# Altium schematic sheet DAC.SchDoc
size B; SheetNumber: 4; SheetTotal: 8
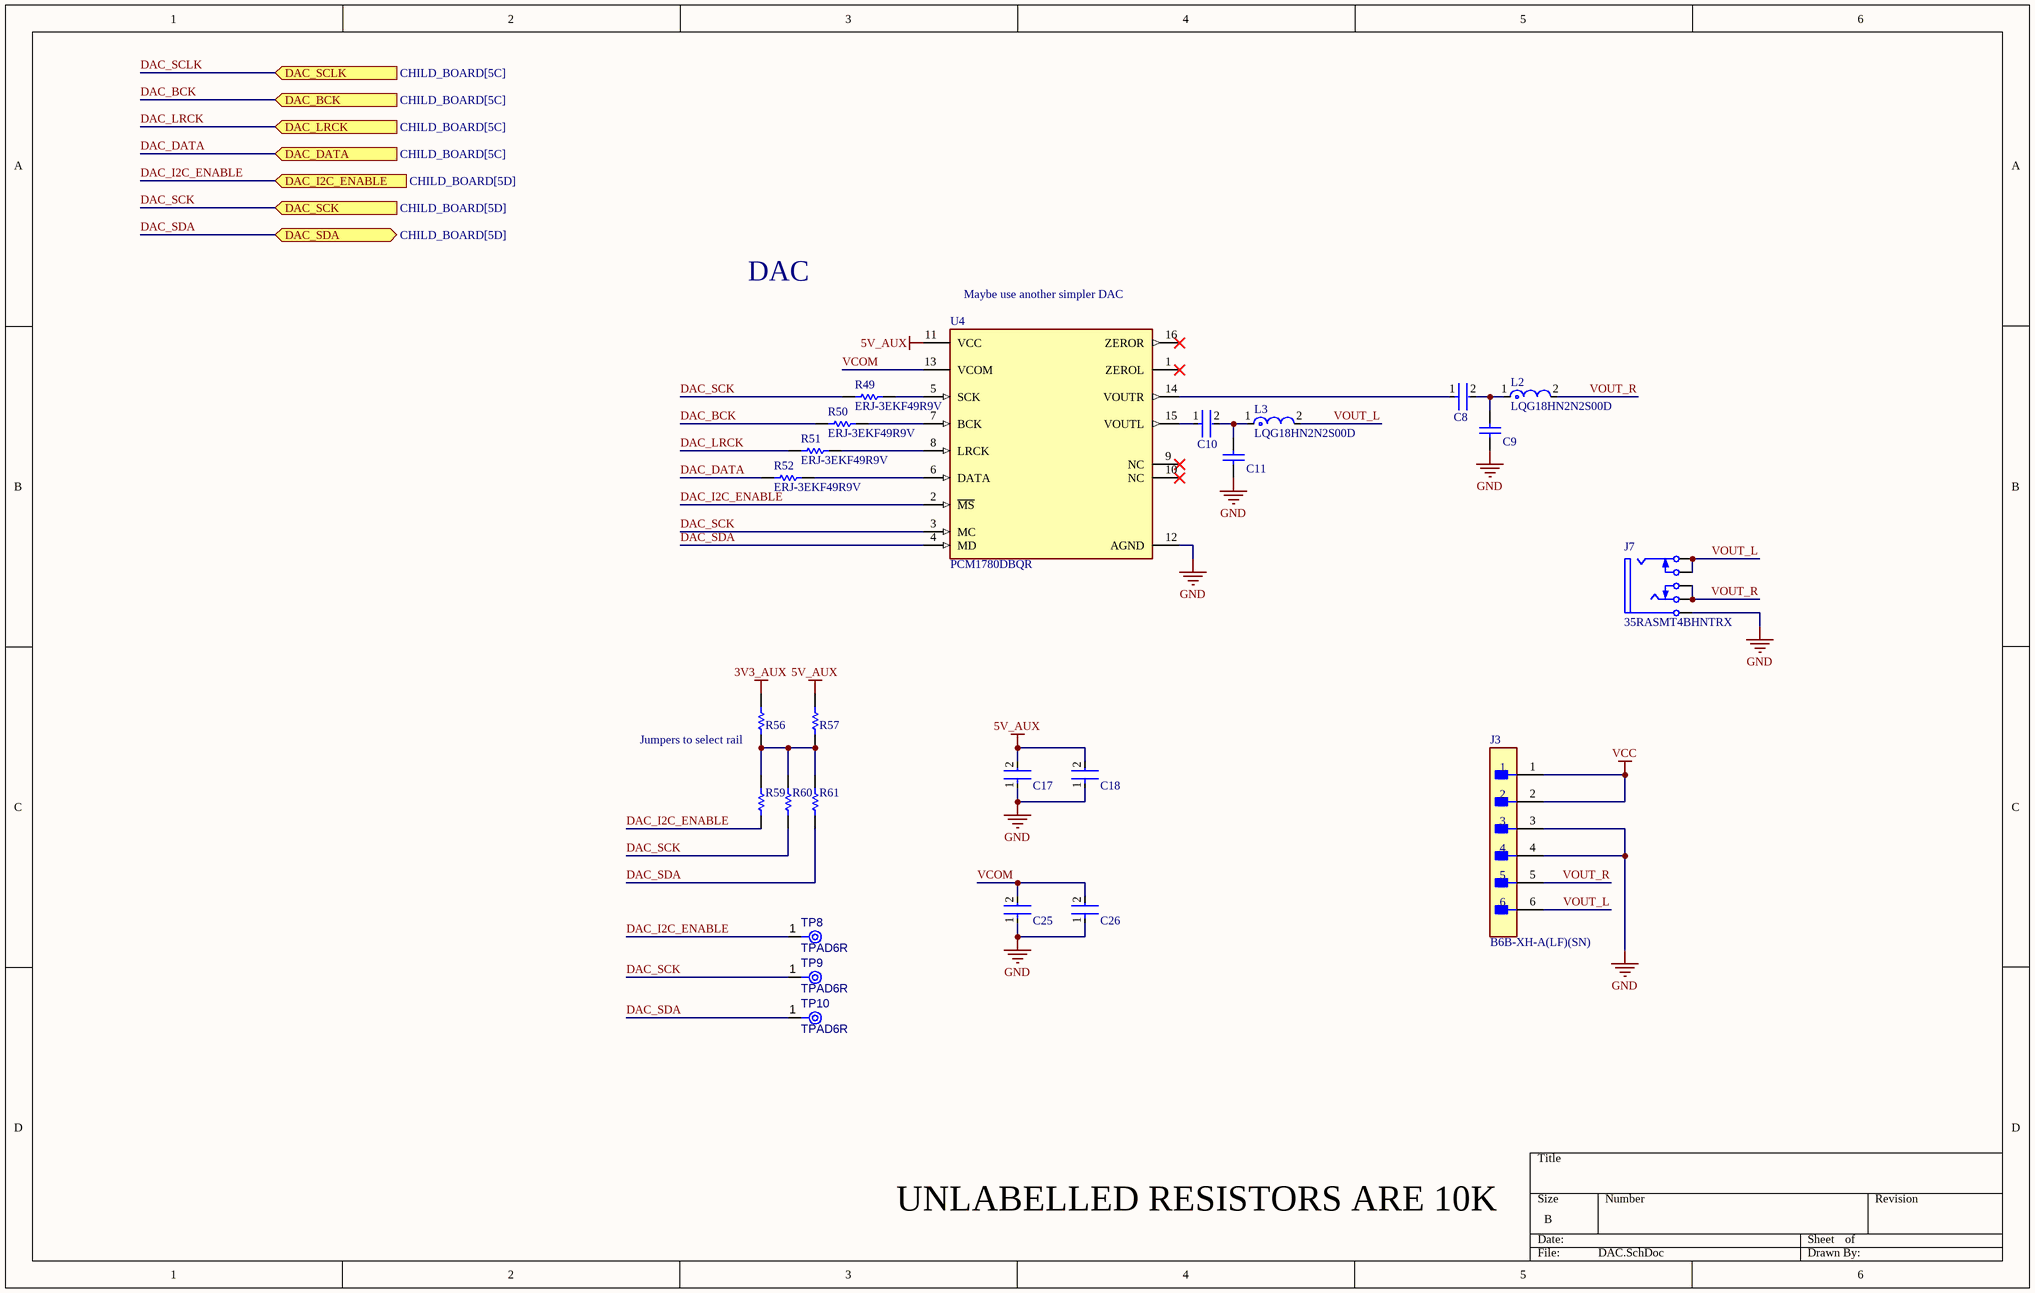
[diagram p0: DAC.SchDoc]

## Parts
C8  GRM188R60J106ME47D  [FP-GRM188-0_1-e0_2_0_55-IPC_A]  (value not drawn)
C9  0603 CAP  [CAPC1608X90X40ML10T20]  (value not drawn)
C10  GRM188R60J106ME47D  [FP-GRM188-0_1-e0_2_0_55-IPC_A]  (value not drawn)
C11  0603 CAP  [CAPC1608X90X40ML10T20]  (value not drawn)
C17  GRM188R60J106ME47D  [FP-GRM188-0_1-e0_2_0_55-IPC_A]  (value not drawn)
C18  C1005X7R1H104K050BB  [FP-C1005-050-0_05-IPC_C]  (value not drawn)
C25  GRM188R60J106ME47D  [FP-GRM188-0_1-e0_2_0_55-IPC_A]  (value not drawn)
C26  C1005X7R1H104K050BB  [FP-C1005-050-0_05-IPC_C]  (value not drawn)
J3  B6B-XH-A(LF)(SN)  [FP-B6B-XH-A_LF_SN-MFG]
J7  35RASMT4BHNTRX  [SWIT-35RASMT4BHNTRX_V]
L2  LQG18HN2N2S00D  [FP-LQG18HH_00-IPC_A]
L3  LQG18HN2N2S00D  [FP-LQG18HH_00-IPC_A]
R49  ERJ-3EKF49R9V  [RESC1608X55X30ML15T15]
R50  ERJ-3EKF49R9V  [RESC1608X55X30ML15T15]
R51  ERJ-3EKF49R9V  [RESC1608X55X30ML15T15]
R52  ERJ-3EKF49R9V  [RESC1608X55X30ML15T15]
R56  0402 JUMPER 0 OHM  [RESC1005X40X25NL05T05]  (value not drawn)
R57  0402 JUMPER 0 OHM  [RESC1005X40X25NL05T05]  (value not drawn)
R59  ERJ3EKF1002V  [RESC1609X55X30LL15T15]  (value not drawn)
R60  ERJ3EKF1002V  [RESC1609X55X30LL15T15]  (value not drawn)
R61  ERJ3EKF1002V  [RESC1609X55X30LL15T15]  (value not drawn)
TP8  TPAD6R  [TP06R]  (no BOM)
TP9  TPAD6R  [TP06R]  (no BOM)
TP10  TPAD6R  [TP06R]  (no BOM)
U4  PCM1780DBQR  [FP-DBQ0016A-IPC_C]

## Ports
DAC_BCK (in, see CHILD_BOARD[5C]), DAC_DATA (in, see CHILD_BOARD[5C]), DAC_I2C_ENABLE (in, see CHILD_BOARD[5D]), DAC_LRCK (in, see CHILD_BOARD[5C]), DAC_SCK (in, see CHILD_BOARD[5D]), DAC_SCLK (in, see CHILD_BOARD[5C]), DAC_SDA (bidir, see CHILD_BOARD[5D])

## Nets
3V3_AUX: R56.2
5V_AUX: C17.2 C18.2 R57.2 U4.11(VCC)
GND: C9.1 C11.1 C17.1 C18.1 C25.1 C26.1 J3.3 J3.4 J7.1 U4.12(AGND)
VCC: J3.1 J3.2
DAC_BCK: R50.2 ; port DAC_BCK
DAC_DATA: R52.2 ; port DAC_DATA
DAC_I2C_ENABLE: R59.1 TP8.1(TP) U4.2(~{MS}) ; port DAC_I2C_ENABLE
DAC_LRCK: R51.2 ; port DAC_LRCK
DAC_SCK: R49.2 R60.1 TP9.1(TP) U4.3(MC) ; port DAC_SCK
DAC_SCLK: port DAC_SCLK
DAC_SDA: R61.1 TP10.1(TP) U4.4(MD) ; port DAC_SDA
VCOM: C25.2 C26.2 U4.13(VCOM)
VOUT_L: J3.6 J7.2 J7.4 L3.2
VOUT_R: J3.5 J7.3 J7.5 L2.2
NetC8_1: C8.1 U4.14(VOUTR)
NetC8_2: C8.2 C9.2 L2.1
NetC10_1: C10.1 U4.15(VOUTL)
NetC10_2: C10.2 C11.2 L3.1
NetR49_1: R49.1 U4.5(SCK)
NetR50_1: R50.1 U4.7(BCK)
NetR51_1: R51.1 U4.8(LRCK)
NetR52_1: R52.1 U4.6(DATA)
NetR56_1: R56.1 R57.1 R59.2 R60.2 R61.2

Not connected (* = marked no-connect by the designer): U4 1(ZEROL)* 9(NC)* 10(NC)* 16(ZEROR)*

## Notes on the sheet
- DAC
- (near U4) Maybe use another simpler DAC
- (near R56) Jumpers to select rail
- UNLABELLED RESISTORS ARE 10K

## Library data of the parts
C8 C10 C17 C25 = CMP-2006-02792-2: Chip Multilayer Ceramic Capacitors for General Purpose, 0603, 10uF, X5R, 15%, 20%, 6.3V; Packaging: Tape and Reel; Voltage Rating (DC): 6.3V; Width: 0.031inch; Termination: SMD/SMT; Dielectric: X5R; Package Quantity: 4000; Voltage Rating: 6.3V; Capacitance: 10uF; Case/Package: 0603; Min Operating Temperature: -55°C; Voltage: 6.3V; Length: 1.6mm; Thickness: 0.035inch; Lead Free: Lead Free; Depth: 0.8mm; Case Code (Imperial): 0603; Max Operating Temperature: 85°C; Material: Ceramic; Height: 0.8mm; Tolerance: 20%; Mount: Surface Mount; REACH SVHC: No SVHC; Radiation Hardening: No; Case Code (Metric): 1608
C9 C11 = CMP-001-00087-1: 0pF 0603 capacitor placeholder
C18 C26 = CMP-2000-05393-2: Multilayer Ceramic Capacitors 100nF ±10% 50V X7R SMD 0402; Voltage: 50V; Dielectric Material: Ceramic; Min Operating Temperature: -55°C; Depth: 0.5mm; Radiation Hardening: No; RoHS Compliant: Yes; Voltage Rating (DC): 50V; Lead Free: Lead Free; Resistor Type: Ceramic; Height: 0.5mm; Dielectric: X7R; Thickness: 0.022inch; Case/Package: 0402; Case Code (Metric): 1005; Termination: SMD/SMT; Capacitance: 100nF; Packaging: Tape and Reel; Max Operating Temperature: 125°C; Mount: Surface Mount; Package Quantity: 1; Width: 0.02inch; Weight: 2.3E-05oz; Voltage Rating: 50V; Tolerance: 10%; Construction: Flat; Case Code (Imperial): 0402; Length: 1mm; REACH SVHC: No SVHC; Series: C
J3 = CMP-17439-000076-1: CONN HEADER VERT 6POS 2.5MM
J7 = CMP-1772-00001-1: Female 3.5 mm Phone Jack, 5 Position, Height 5 mm, RoHS, Tape and Reel; Current Rating: 50 mA; Voltage Rating (DC): 12 V; ComponentLink1URL: http://www.switchcraft.com/; ComponentLink2Description: Datasheet; ComponentLink2URL: http://www.switchcraft.com/Drawings/35rasmt4bhntrx_cd.pdf; PackageDescription: Female 3.5 mm Phone Jack, 5 Position, Height 5 mm; PackageReference: 35RASMT4BHNTRX; Mount: Through Hole; DatasheetVersion: Rev. C, 07/2014; Contact Material: Silver; ComponentLink1Description: Manufacturer URL; Packaging: Tape and Reel; RoHSCompliant: true; Contact Plating: Silver; Package Quantity: 3000
L2 L3 = CMP-06042-006288-1: Multilayer type RF Inductor 2.2nH ±0.3nH 0.1Ω 1100mA 0603; Max DC Current: 500mA; Core Material: Air; Self Resonant Frequency: 6GHz; Q Factor: 12; DC Resistance (DCR): 100mR; Shielding: Unshielded; Test Frequency: 100MHz; Inductance: 2.2nH; Depth: 0.95mm; Current Rating: 500mA; Packaging: Tape and Reel; Case/Package: 0603; Height - Seated (Max): 0.037inch; Mount: Surface Mount; Radiation Hardening: No; Max Operating Temperature: 85°C; Length: 0.063inch; Termination: SMD/SMT; Lead Free: Lead Free; Min Operating Temperature: -40°C; Number of Pins: 2; Case Code (Metric): 1608; Height: 0.8mm; REACH SVHC: No SVHC; Package Quantity: 4000; DC Current: 500mA; Width: 0.031inch; Military Standard: Not; Case Code (Imperial): 0603
R49-R52 = CMP-2000-00538-1: Manufacturer: Panasonic; Part Number: ERJ-3EKF49R9V
R56 R57 = CMP-009-00206-2: READ THE NAME
R59-R61 = CMP-1012-00623-3: Chip Resistor, 10 KOhm, +/- 1%, 0.1 W, -55 to 155 degC, 0603 (1608 Metric), RoHS, Tape and Reel; Manufacturer: Panasonic; Voltage Rating: 75V; Case\/Package: 0603; Power Rating: 100mW; Resistance: 10KOhm; Temperature Coefficient: 100ppm\/degreesC; Number of Pins: 2; Package Reference: 603; Depth: 0.8mm; Mount: SurfaceMount; Package Description: 2-Pin Surface Mount Device, Body 1.6 x 0.85 mm; Datasheet Version: 02/2017; Length: 1.6mm; Lead Free: LeadFree; Height: 0.45mm; Number of Terminations: 2; Max Power Dissipation: 100mW; Min Operating Temperature: -55degC; Datasheet URL: https://industrial.panasonic.com/cdbs/www-data/pdf/RDA0000/AOA0000C304.pdf; Termination: SMD/SMT; Case Code (Metric): 1608; Case Code (Imperial): 0603; Tolerance: 1%; Max Operating Temperature: 155degC; RoHSCompliant: true; Voltage Rating (DC): 75V; Radiation Hardening: No; Packaging: TapeandReel; Composition: ThickFilm; Mounting Technology: SurfaceMount; Manufacturer URL: http://www.panasonic.com/; Width: 0.031inch; REACH SVHC: NoSVHC; Contact Plating: Tin; Military Standard: Not; Package Quantity: 1
TP8-TP10 = CMP-00028-00002-2: 0.6mm round; Pins: 1
U4 = CMP-04861-000034-1: IC DAC/AUDIO 24BIT 200K 16SSOP; Number of Channels: 2; Operating Supply Voltage: 5V; Conversion Rate: 192KS/s; Number of Analog Inputs: 0; Number of Bits: 24; Max Supply Voltage: 5.5V; Min Supply Voltage: 4.5V; Signal to Noise Ratio (SNR): 106dB; Max Power Dissipation: 200mW; Resolution: 24b; Interface: Serial; Output Type: Voltage; Sampling Rate: 200000S/s; Supply Type: Single; Power Consumption: 80mW; Nominal Supply Current: 30mA; Radiation Hardening: No; Number of Pins: 16; Packaging: Tape and Reel; Lead Free: Lead Free; Min Operating Temperature: -25°C; Number of Analog Outputs: 2; Weight: 0.002469oz; Package Quantity: 2000; Series: -; Number of Converters: 2; Case/Package: SSOP; Number of DAC Channels: 2; RoHS Compliant: Yes; Max Operating Temperature: 85°C; Mount: Surface Mount